# Altium schematic sheet ESP32 with USBC.SchDoc (part 2 of 3)
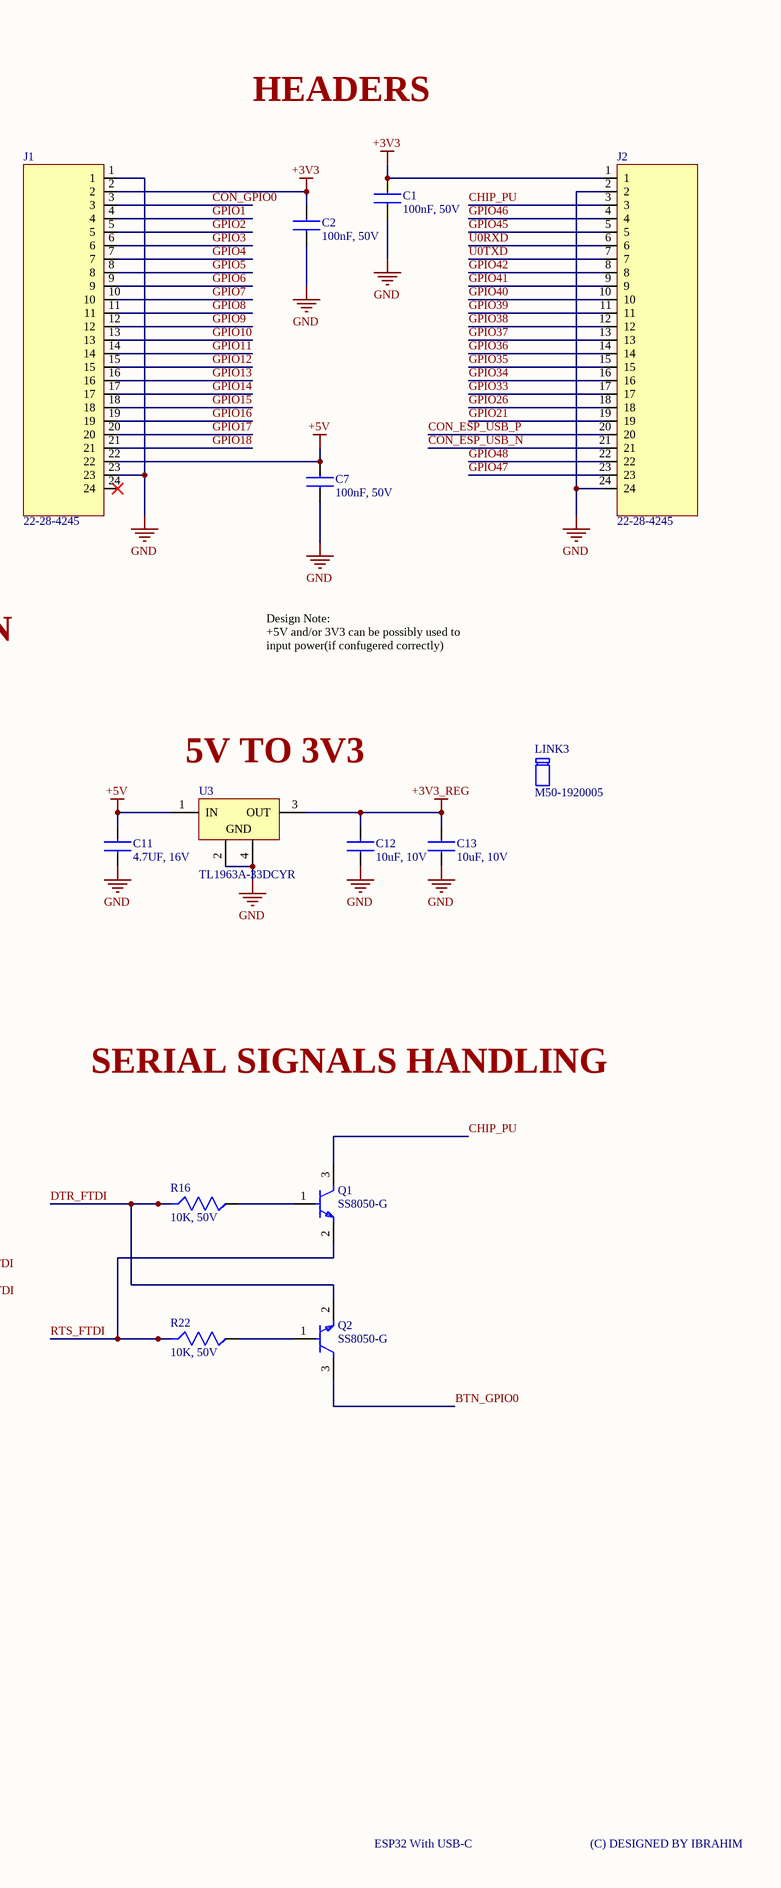
[diagram p2: ESP32 with USBC.SchDoc, right]
## Library data of the parts
C1-C3 C5-C10 C15 C17 = CL05B104KB54PNC: CAP CER 0.1UF 50V X7R 0402; Manufacturer: Samsung Electro-Mechanics; Dielectric Material: Ceramic; Tolerance: 10%; Supplier: DigiKey; Supplier Part Number: 1276-CL05B104KB54PNCCT-ND; Manufacturer Part Number: CL05B104KB54PNC; RoHS: Compliant; Category: Ceramic Capacitors; Pricing: 1=0.1, 10=0.036, 50=0.0246, 100=0.021, 500=0.01504, 1000=0.01387, 2500=0.01274, 5000=0.01196 (USD); Value: 100nF; Case/Package: 0402; China RoHS: Compliant; Height: 500µm; Length: 1mm; Lifecycle Status: Production; Material: Ceramic; Max Operating Temperature: 125°C; Min Operating Temperature: -55°C; Mounting Technology: Surface Mount; Number of Terminals: 2; REACH SVHC: Yes; Schedule B: 8532240020, 8532240020|8532240020|8532240020|8532240020|8532240020|8532240020|8532240020|8532240020|8532240020|8532240020|8532240020|8532240020|8532240020|8532240020|8532240020|8532240020|8532240020|8532240020|8532240020|8532240020|8532240020|8532240020|8532240020|85; Voltage Rating: 50V; Voltage Rating (DC): 50V; Width: 500µm; ComponentLink1URL: https://datasheet.octopart.com:443/CL05B104KB54PNC-Samsung-Electro-Mechanics-datasheet-182018727.pdf?src-supplier=IHS; ComponentLink1Description: https://datasheet.octopart.com:443/CL05B104KB54PNC-Samsung-Electro-Mechanics-datasheet-182018727.pdf?src-supplier=IHS; ComponentLink2URL: https://datasheet.octopart.com:443/CL05B104KB54PNC-Samsung-Electro-Mechanics-datasheet-138685816.pdf?src-supplier=Samsung+SCT; ComponentLink2Description: https://datasheet.octopart.com:443/CL05B104KB54PNC-Samsung-Electro-Mechanics-datasheet-138685816.pdf?src-supplier=Samsung+SCT; ComponentLink3URL: https://datasheet.octopart.com:443/CL05B104KB54PNC-Samsung-datasheet-8326407.pdf?src-supplier=TME; ComponentLink3Description: https://datasheet.octopart.com:443/CL05B104KB54PNC-Samsung-datasheet-8326407.pdf?src-supplier=TME; LCSC Part Number: C307331
C4 C11 = CMP-13271-001468-1: CAP CER 4.7UF 16V X5R 0402; Tolerance: 20%; Mount: Surface Mount; Case Code (Metric): 1005; Case/Package: 0402; Length: 0.039inch; Capacitance: 4.7uF; Voltage Rating: 16V; Max Operating Temperature: 85°C; Thickness: 0.022inch; Min Operating Temperature: -55°C; Case Code (Imperial): 0402; Packaging: Tape and Reel; Width: 0.02inch; LCSC Part Number: C318563
C12-C14 = CL05A106MP8NUB8: CAP CER 10UF 10V X5R 0402; Manufacturer: Samsung Electro-Mechanics; Value: 10µF; Dielectric Material: Ceramic; Tolerance: 20%; Supplier: DigiKey; Supplier Part Number: 1276-6830-1-ND; Manufacturer Part Number: CL05A106MP8NUB8; RoHS: Compliant; Category: Ceramic Capacitors; Stock: 167797; Pricing: 1=0.13, 10=0.077, 50=0.0678 (USD); Case/Package: 0402; Case Code (Imperial): 0402; Case Code (Metric): 1005; China RoHS: Compliant; Height: 800µm; Length: 1mm; Lifecycle Status: Production; Material: Ceramic; Max Operating Temperature: 85°C; Min Operating Temperature: -55°C; Mounting Technology: Surface Mount; Number of Terminals: 2; REACH SVHC: Yes; Schedule B: 8532240020, 8532240020|8532240020, 8532240020|8532240020|8532240020, 8532240020|8532240020|8532240020|8532240020; Thickness: 889µm; Voltage Rating: 10V; Voltage Rating (DC): 10V; Width: 500µm; ComponentLink1URL: https://datasheet.octopart.com:443/CL05A106MP8NUB8-Samsung-Electro-Mechanics-datasheet-136460857.pdf?src-supplier=IHS; ComponentLink1Description: https://datasheet.octopart.com:443/CL05A106MP8NUB8-Samsung-Electro-Mechanics-datasheet-136460857.pdf?src-supplier=IHS; ComponentLink2URL: https://datasheet.octopart.com:443/CL05A106MP8NUB8-Samsung-Electro-Mechanics-datasheet-181551178.pdf?src-supplier=Newark; ComponentLink2Description: https://datasheet.octopart.com:443/CL05A106MP8NUB8-Samsung-Electro-Mechanics-datasheet-181551178.pdf?src-supplier=Newark; ComponentLink3URL: https://datasheet.octopart.com:443/CL05A106MP8NUB8-Samsung-Electro-Mechanics-datasheet-136031724.pdf?src-supplier=Newark; ComponentLink3Description: https://datasheet.octopart.com:443/CL05A106MP8NUB8-Samsung-Electro-Mechanics-datasheet-136031724.pdf?src-supplier=Newark; ComponentLink4URL: https://datasheet.octopart.com:443/CL05A106MP8NUB8-Samsung-Electro-Mechanics-datasheet-141346815.pdf?src-supplier=Samsung+SCT; ComponentLink4Description: https://datasheet.octopart.com:443/CL05A106MP8NUB8-Samsung-Electro-Mechanics-datasheet-141346815.pdf?src-supplier=Samsung+SCT; ComponentLink5URL: https://datasheet.octopart.com:443/CL05A106MP8NUB8-Samsung-Electro-Mechanics-datasheet-110326781.pdf?src-supplier=Future+Electronics; ComponentLink5Description: https://datasheet.octopart.com:443/CL05A106MP8NUB8-Samsung-Electro-Mechanics-datasheet-110326781.pdf?src-supplier=Future+Electronics; ComponentLink6URL: https://datasheet.octopart.com:443/CL05A106MP8NUB8-Samsung-Electro-Mechanics-datasheet-96443587.pdf?src-supplier=Future+Electronics; ComponentLink6Description: https://datasheet.octopart.com:443/CL05A106MP8NUB8-Samsung-Electro-Mechanics-datasheet-96443587.pdf?src-supplier=Future+Electronics; ComponentLink7URL: https://datasheet.octopart.com:443/CL05A106MP8NUB8-Samsung-Electro-Mechanics-datasheet-68297032.pdf?src-supplier=Future+Electronics; ComponentLink7Description: https://datasheet.octopart.com:443/CL05A106MP8NUB8-Samsung-Electro-Mechanics-datasheet-68297032.pdf?src-supplier=Future+Electronics; ComponentLink8URL: https://datasheet.octopart.com:443/CL05A106MP8NUB8-Samsung-Electro-Mechanics-datasheet-86032222.pdf?src-supplier=Future+Electronics; ComponentLink8Description: https://datasheet.octopart.com:443/CL05A106MP8NUB8-Samsung-Electro-Mechanics-datasheet-86032222.pdf?src-supplier=Future+Electronics; LCSC Part Number: C307415
C16 = CL05A105KL5NRNC: CAP CER 1UF 35V X5R 0402; Manufacturer: Samsung Electro-Mechanics; Value: 1µF; Dielectric Material: Ceramic; Tolerance: 10%; Supplier: DigiKey; Supplier Part Number: 1276-6796-1-ND; Manufacturer Part Number: CL05A105KL5NRNC; RoHS: Compliant; Category: Ceramic Capacitors; Stock: 182369; Pricing: 1=0.27, 10=0.159, 50=0.1154, 100=0.102, 500=0.08134, 1000=0.07576, 2500=0.07016, 5000=0.06315 (USD); Case/Package: 0402; Case Code (Imperial): 0402; Case Code (Metric): 1005; China RoHS: Compliant; Height: 550µm; Length: 990.6µm; Lifecycle Status: Production; Material: Ceramic; Max Operating Temperature: 85°C; Min Operating Temperature: -55°C; Mounting Technology: Surface Mount; Number of Terminals: 2; REACH SVHC: Yes; Schedule B: 8532240020, 8532240020|8532240020|8532240020|8532240020|8532240020; Thickness: 558.8µm; Voltage Rating: 35V; Voltage Rating (DC): 35V; Width: 508µm; ComponentLink1URL: https://datasheet.octopart.com:443/CL05A105KL5NRNC-Samsung-Electro-Mechanics-datasheet-182018568.pdf?src-supplier=IHS; ComponentLink1Description: https://datasheet.octopart.com:443/CL05A105KL5NRNC-Samsung-Electro-Mechanics-datasheet-182018568.pdf?src-supplier=IHS; ComponentLink2URL: https://datasheet.octopart.com:443/CL05A105KL5NRNC-Samsung-Electro-Mechanics-datasheet-141346806.pdf?src-supplier=Samsung+SCT; ComponentLink2Description: https://datasheet.octopart.com:443/CL05A105KL5NRNC-Samsung-Electro-Mechanics-datasheet-141346806.pdf?src-supplier=Samsung+SCT; ComponentLink3URL: https://datasheet.octopart.com:443/CL05A105KL5NRNC-Samsung-datasheet-8326407.pdf?src-supplier=TME; ComponentLink3Description: https://datasheet.octopart.com:443/CL05A105KL5NRNC-Samsung-datasheet-8326407.pdf?src-supplier=TME; LCSC Part Number: C307413
D1 = VLMG1500-GS08: LED YLW-GRN 0402 SMD; Manufacturer: Vishay; Color: Green, Yellow; Dominant Wavelength: 571nm; Forward Current: 30mA; Forward Voltage: 2.4V; Lens Color: Clear; Lens Style: Rectangular; Luminous Intensity: 18mcd; Number of Circuits: 1; Power Dissipation: 75mW; Reverse Voltage: 5V; Test Current: 20mA; Viewing Angle: 130°; Supplier: DigiKey; Supplier Part Number: VLMG1500-GS08CT-ND; Manufacturer Part Number: VLMG1500-GS08; RoHS: Compliant; Category: LEDs; Stock: 161716; Pricing: 1=0.24, 10=0.164, 100=0.1147, 500=0.09218, 1000=0.0847 (USD); Ambient Temperature Range High: 85°C; Case/Package: 0402; Case Code (Imperial): 0402; Case Code (Metric): 1005; Depth: 500µm; Height: 350µm; Illumination Color: Green; Lead Free: Lead Free; Length: 1mm; Lifecycle Status: Production; Max Operating Temperature: 85°C; Min Operating Temperature: -30°C; Mounting Technology: Surface Mount; Number of Elements: 1; Number of LEDs: 1; Pins: 2; Number of Terminals: 2; Packaging: Cut Tape; Peak Wavelength: 571nm; Power Rating: 75mW; Radiation Hardening: No; REACH SVHC: Yes; Schedule B: 8541402000, 8541402000|8541402000|8541402000|8541402000|8541402000; Shape: Rectangular; Terminal Pitch: 675µm; Wavelength: 571nm; Width: 500µm; ComponentLink1URL: https://datasheet.octopart.com:443/VLMG1500-GS08-Vishay-datasheet-181477802.pdf?src-supplier=IHS; ComponentLink1Description: https://datasheet.octopart.com:443/VLMG1500-GS08-Vishay-datasheet-181477802.pdf?src-supplier=IHS; ComponentLink2URL: https://datasheet.octopart.com:443/VLMG1500-GS08-Vishay-datasheet-21227148.pdf?src-supplier=element14+APAC; ComponentLink2Description: https://datasheet.octopart.com:443/VLMG1500-GS08-Vishay-datasheet-21227148.pdf?src-supplier=element14+APAC; ComponentLink3URL: https://datasheet.octopart.com:443/VLMG1500-GS08-Vishay-datasheet-33014519.pdf?src-supplier=element14+APAC; ComponentLink3Description: https://datasheet.octopart.com:443/VLMG1500-GS08-Vishay-datasheet-33014519.pdf?src-supplier=element14+APAC; ComponentLink4URL: https://datasheet.octopart.com:443/VLMG1500-GS08-Vishay-datasheet-62332426.pdf?src-supplier=Newark; ComponentLink4Description: https://datasheet.octopart.com:443/VLMG1500-GS08-Vishay-datasheet-62332426.pdf?src-supplier=Newark; ComponentLink5URL: https://datasheet.octopart.com:443/VLMG1500-GS08-Vishay-datasheet-102762782.pdf?src-supplier=Future+Electronics; ComponentLink5Description: https://datasheet.octopart.com:443/VLMG1500-GS08-Vishay-datasheet-102762782.pdf?src-supplier=Future+Electronics; ComponentLink6URL: https://datasheet.octopart.com:443/VLMG1500-GS08-Vishay-datasheet-68326145.pdf?src-supplier=TME; ComponentLink6Description: https://datasheet.octopart.com:443/VLMG1500-GS08-Vishay-datasheet-68326145.pdf?src-supplier=TME; ComponentLink7URL: http://sigma.octopart.com:80/rohs_statement/Vishay-company-15.pdf?src-supplier=Compliance+Statements; ComponentLink7Description: http://sigma.octopart.com:80/rohs_statement/Vishay-company-15.pdf?src-supplier=Compliance+Statements; LCSC Part Number: C511404
D2 = VLMS1500-GS08: LED RED 0402 SMD; Manufacturer: Vishay; Dominant Wavelength: 631nm; Forward Current: 30mA; Forward Voltage: 2.4V; Lens Style: Rectangular, Square; Luminous Intensity: 18mcd; Number of Circuits: 1; Power Rating: 75mW; Reverse Voltage: 5V; Shape: Rectangular; Test Current: 20mA; Viewing Angle: 130°; Supplier: DigiKey; Supplier Part Number: VLMS1500-GS08CT-ND; Manufacturer Part Number: VLMS1500-GS08; RoHS: Compliant; Category: LEDs; Stock: 40375; Pricing: 1=0.24, 10=0.164, 100=0.1147, 500=0.09218, 1000=0.0847 (USD); Case/Package: 0402; Case Code (Imperial): 0402; Case Code (Metric): 1005; Color: Red; Height: 350µm; Illumination Color: Red; Lead Free: Lead Free; Length: 1mm; Lifecycle Status: Production; Max Operating Temperature: 85°C; Min Operating Temperature: -30°C; Mounting Technology: Surface Mount; Number of LEDs: 1; Pins: 2; Number of Terminals: 2; Packaging: Cut Tape; Peak Wavelength: 631nm; Radiation Hardening: No; REACH SVHC: Yes; Schedule B: 8541402000, 8541402000|8541402000|8541402000|8541402000|8541402000; Terminal Pitch: 675µm; Wavelength: 631nm; Width: 500µm; ComponentLink1URL: https://datasheet.octopart.com:443/VLMS1500-GS08-Vishay-datasheet-181477802.pdf?src-supplier=IHS; ComponentLink1Description: https://datasheet.octopart.com:443/VLMS1500-GS08-Vishay-datasheet-181477802.pdf?src-supplier=IHS; ComponentLink2URL: https://datasheet.octopart.com:443/VLMS1500-GS08-Vishay-datasheet-21227148.pdf?src-supplier=Future+Electronics; ComponentLink2Description: https://datasheet.octopart.com:443/VLMS1500-GS08-Vishay-datasheet-21227148.pdf?src-supplier=Future+Electronics; ComponentLink3URL: https://datasheet.octopart.com:443/VLMS1500-GS08-Vishay-datasheet-102762782.pdf?src-supplier=Future+Electronics; ComponentLink3Description: https://datasheet.octopart.com:443/VLMS1500-GS08-Vishay-datasheet-102762782.pdf?src-supplier=Future+Electronics; ComponentLink4URL: https://datasheet.octopart.com:443/VLMS1500-GS08-Vishay-datasheet-33014519.pdf?src-supplier=element14+APAC; ComponentLink4Description: https://datasheet.octopart.com:443/VLMS1500-GS08-Vishay-datasheet-33014519.pdf?src-supplier=element14+APAC; ComponentLink5URL: https://datasheet.octopart.com:443/VLMS1500-GS08-Vishay-datasheet-68326145.pdf?src-supplier=TME; ComponentLink5Description: https://datasheet.octopart.com:443/VLMS1500-GS08-Vishay-datasheet-68326145.pdf?src-supplier=TME; ComponentLink6URL: https://datasheet.octopart.com:443/VLMS1500-GS08-Vishay-Siliconix-datasheet-62309867.pdf?src-supplier=RS+(Formerly+Allied+Electronics); ComponentLink6Description: https://datasheet.octopart.com:443/VLMS1500-GS08-Vishay-Siliconix-datasheet-62309867.pdf?src-supplier=RS+(Formerly+Allied+Electronics); ComponentLink7URL: https://datasheet.octopart.com:443/VLMS1500-GS08-Vishay-datasheet-62332426.pdf?src-supplier=Newark; ComponentLink7Description: https://datasheet.octopart.com:443/VLMS1500-GS08-Vishay-datasheet-62332426.pdf?src-supplier=Newark; ComponentLink8URL: https://datasheet.octopart.com/VLMS1500-GS08-Vishay-datasheet-16093911.pdf; ComponentLink8Description: https://datasheet.octopart.com/VLMS1500-GS08-Vishay-datasheet-16093911.pdf; ComponentLink9URL: http://sigma.octopart.com:80/rohs_statement/Vishay-company-15.pdf?src-supplier=Compliance+Statements; ComponentLink9Description: http://sigma.octopart.com:80/rohs_statement/Vishay-company-15.pdf?src-supplier=Compliance+Statements; LCSC Part Number: C511370
D3-D8 = AQ3045-01ETG: TVS DIODE 5.3VWM 12VC SOD882; Manufacturer: Littelfuse; Breakdown Voltage: 7.8V; Clamping Voltage: 12V; Leakage Current: 100nA; Max Breakdown Voltage: 9V; Min Breakdown Voltage: 6.8V; Number of Channels: 1; Operating Supply Voltage: 5.3V; Peak Pulse Power: 40W; Polarity: Bidirectional; Supplier: DigiKey; Supplier Part Number: F9321CT-ND; Manufacturer Part Number: AQ3045-01ETG; RoHS: Compliant; Category: TVS Diodes; Stock: 10179; Pricing: 1=0.43, 10=0.271, 100=0.141, 500=0.131 (USD); Lifecycle Status: Production; Max Operating Temperature: 150°C; Min Operating Temperature: -40°C; Mounting Technology: Surface Mount; Number of Elements: 1; Number of Terminals: 2; Packaging: Cut Tape; Peak Reverse Current: 100nA; REACH SVHC: Yes; Reverse Standoff Voltage: 5.3V; ComponentLink1URL: https://datasheet.octopart.com:443/AQ3045-01ETG-Littelfuse-datasheet-180606588.pdf?src-supplier=IHS; ComponentLink1Description: https://datasheet.octopart.com:443/AQ3045-01ETG-Littelfuse-datasheet-180606588.pdf?src-supplier=IHS; ComponentLink2URL: https://datasheet.octopart.com:443/AQ3045-01ETG-Littelfuse-datasheet-140480283.pdf?src-supplier=ODG+(Origin+Data+Global); ComponentLink2Description: https://datasheet.octopart.com:443/AQ3045-01ETG-Littelfuse-datasheet-140480283.pdf?src-supplier=ODG+(Origin+Data+Global); ComponentLink3URL: https://datasheet.octopart.com:443/AQ3045-01ETG-Littelfuse-datasheet-101609968.pdf?src-supplier=Farnell; ComponentLink3Description: https://datasheet.octopart.com:443/AQ3045-01ETG-Littelfuse-datasheet-101609968.pdf?src-supplier=Farnell; ComponentLink4URL: https://datasheet.octopart.com:443/AQ3045-01ETG-Littelfuse-datasheet-183003566.pdf?src-supplier=JRH+Electronics; ComponentLink4Description: https://datasheet.octopart.com:443/AQ3045-01ETG-Littelfuse-datasheet-183003566.pdf?src-supplier=JRH+Electronics; ComponentLink5URL: https://datasheet.octopart.com:443/AQ3045-01ETG-Littelfuse-datasheet-170904929.pdf?src-supplier=Future+Electronics; ComponentLink5Description: https://datasheet.octopart.com:443/AQ3045-01ETG-Littelfuse-datasheet-170904929.pdf?src-supplier=Future+Electronics; LCSC Part Number: C3710326
J1 J2 = 22-28-4245: Conn Unshrouded Header HDR 24 POS 2.54mm Solder ST Thru-Hole KK® Bag; Manufacturer: Molex; Manufacturer Lifecycle Status: ACTIVE; Contact Resistance: 20mΩ; Current Rating: 4A; Gender: Male; Insulation Resistance: 50GΩ; Number of Circuits: 24; Plating: Tin; Plating Thickness: 381nm; Supplier: DigiKey; Supplier Part Number: 900-0022284245-ND; Manufacturer Part Number: 22-28-4245; RoHS: Compliant; Category: Headers and Wire Housings; Stock: 1314; Pricing: 1=1.21, 10=1.024, 100=0.8699, 500=0.77638, 1000=0.73932, 5000=0.65998, 10000=0.62851 (USD); China RoHS: Compliant; Contact Gender: Male; Contact Material: Brass; Contact Plating: Gold; Country of Origin: US; Housing Color: Black; Lead Free: Lead Free; Lifecycle Status: Production; Max Operating Temperature: 75°C; Min Operating Temperature: -40°C; Mounting Technology: Through Hole; Number of Contacts: 24; Pins: 24; Number of Positions: 24; Number of Rows: 1; Orientation: Vertical; Packaging: Bulk; Pitch: 2.54mm; REACH SVHC: Yes; Schedule B: 8536694040, 8536694040|8536694040|8536694040|8536694040|8536694040; Terminal Pitch: 2.54mm; Termination: Solder; ComponentLink1URL: https://datasheet.octopart.com:443/22-28-4245-Molex-datasheet-166051265.pdf?src-supplier=IHS; ComponentLink1Description: https://datasheet.octopart.com:443/22-28-4245-Molex-datasheet-166051265.pdf?src-supplier=IHS; ComponentLink2URL: https://datasheet.octopart.com:443/022284245-Molex-datasheet-8337137.pdf?src-supplier=Arrow+Electronics; ComponentLink2Description: https://datasheet.octopart.com:443/022284245-Molex-datasheet-8337137.pdf?src-supplier=Arrow+Electronics; ComponentLink3URL: https://datasheet.octopart.com:443/22-28-4245-Molex-datasheet-16300812.pdf?src-supplier=Molex; ComponentLink3Description: https://datasheet.octopart.com:443/22-28-4245-Molex-datasheet-16300812.pdf?src-supplier=Molex; ComponentLink4URL: https://sigma.octopart.com:443/16300370/technical_drawing/Molex-22-28-4245.pdf?src-supplier=Molex; ComponentLink4Description: https://sigma.octopart.com:443/16300370/technical_drawing/Molex-22-28-4245.pdf?src-supplier=Molex; ComponentLink5URL: https://datasheet.octopart.com:443/22-28-4245-Molex-datasheet-4210.pdf?src-supplier=DigiKey; ComponentLink5Description: https://datasheet.octopart.com:443/22-28-4245-Molex-datasheet-4210.pdf?src-supplier=DigiKey; ComponentLink6URL: http://sigma.octopart.com:80/16300813/rohs_statement/Molex-22-28-4245.pdf?src-supplier=Compliance+Statements; ComponentLink6Description: http://sigma.octopart.com:80/16300813/rohs_statement/Molex-22-28-4245.pdf?src-supplier=Compliance+Statements; ComponentLink7URL: http://sigma.octopart.com:80/reach_statement/Molex-company-74.pdf?src-supplier=Compliance+Statements; ComponentLink7Description: http://sigma.octopart.com:80/reach_statement/Molex-company-74.pdf?src-supplier=Compliance+Statements; ComponentLink8URL: http://sigma.octopart.com:80/rohs_statement/Molex-company-73.pdf?src-supplier=Compliance+Statements; ComponentLink8Description: http://sigma.octopart.com:80/rohs_statement/Molex-company-73.pdf?src-supplier=Compliance+Statements; ComponentLink9URL: http://sigma.octopart.com:80/conflict_mineral_statement/Molex-company-72.pdf?src-supplier=Compliance+Statements; ComponentLink9Description: http://sigma.octopart.com:80/conflict_mineral_statement/Molex-company-72.pdf?src-supplier=Compliance+Statements; LCSC Part Number: C7145888
J3 J4 = 217179-0001: CONN RCP USB2.0 TYP C 24P SMD RA; Manufacturer: Molex; Contact Resistance: 50mΩ; Current Rating: 1.25A; Dielectric Material: Polyamide; Gender: Receptacle; Insulation Resistance: 100MΩ; Number of Contacts: 16; Number of Ports: 1; Voltage Rating: 30V; Supplier: DigiKey; Supplier Part Number: 900-2171790001CT-ND; Manufacturer Part Number: 217179-0001; RoHS: Compliant; Category: USB Connectors; Stock: 25630; Pricing: 1=0.83, 10=0.704, 25=0.6596, 50=0.628, 100=0.598, 250=0.56052, 500=0.53374 (USD); Contact Gender: Female; Contact Material: Gold, Nickel; Height: 3.36mm; Lifecycle Status: Production; Max Operating Temperature: 85°C; Min Operating Temperature: -40°C; Pins: 16; Number of Rows: 1; REACH SVHC: Yes; Shell Finish: Nickel; Shell Material: Stainless Steel; Terminal Pitch: 500µm; USB Standard: USB 2.0; ComponentLink1URL: https://datasheet.octopart.com:443/217179-0001-Molex-datasheet-158871109.pdf?src-supplier=ODG+(Origin+Data+Global); ComponentLink1Description: https://datasheet.octopart.com:443/217179-0001-Molex-datasheet-158871109.pdf?src-supplier=ODG+(Origin+Data+Global); ComponentLink2URL: https://sigma.octopart.com:443/158871110/technical_drawing/Molex-217179-0001.pdf?src-supplier=Upverter; ComponentLink2Description: https://sigma.octopart.com:443/158871110/technical_drawing/Molex-217179-0001.pdf?src-supplier=Upverter; ComponentLink3URL: https://datasheet.octopart.com:443/217179-0001-Molex-datasheet-164573281.pdf?src-supplier=RS+(Formerly+Allied+Electronics); ComponentLink3Description: https://datasheet.octopart.com:443/217179-0001-Molex-datasheet-164573281.pdf?src-supplier=RS+(Formerly+Allied+Electronics); ComponentLink4URL: http://sigma.octopart.com:80/reach_statement/Molex-company-74.pdf?src-supplier=Compliance+Statements; ComponentLink4Description: http://sigma.octopart.com:80/reach_statement/Molex-company-74.pdf?src-supplier=Compliance+Statements; ComponentLink5URL: http://sigma.octopart.com:80/rohs_statement/Molex-company-73.pdf?src-supplier=Compliance+Statements; ComponentLink5Description: http://sigma.octopart.com:80/rohs_statement/Molex-company-73.pdf?src-supplier=Compliance+Statements; ComponentLink6URL: http://sigma.octopart.com:80/conflict_mineral_statement/Molex-company-72.pdf?src-supplier=Compliance+Statements; ComponentLink6Description: http://sigma.octopart.com:80/conflict_mineral_statement/Molex-company-72.pdf?src-supplier=Compliance+Statements; LCSC Part Number: C3197684
J5 = FTS-102-01-F-S: CONN HEADER VERT 2POS 1.27MM; Manufacturer: Samtec; Manufacturer Lifecycle Status: PRODUCTION; Gender: Male; Number of Contacts: 2; Supplier: DigiKey; Supplier Part Number: SAM15176-ND; Manufacturer Part Number: FTS-102-01-F-S; RoHS: Compliant; Category: Headers and Wire Housings; Pricing: 1=0.49, 50=0.4252, 100=0.3608, 500=0.2994, 1000=0.25609, 2000=0.2556 (USD); Contact Plating: Gold; Lifecycle Status: Production; Mounting Technology: Through Hole; Number of Rows: 1; Packaging: Bulk; Pitch: 1.27mm; Radiation Hardening: No; Termination: Solder; ComponentLink1URL: https://datasheet.octopart.com:443/FTS-102-01-F-S-Samtec-datasheet-97029283.pdf?src-supplier=Newark; ComponentLink1Description: https://datasheet.octopart.com:443/FTS-102-01-F-S-Samtec-datasheet-97029283.pdf?src-supplier=Newark; ComponentLink2URL: https://sigma.octopart.com:443/97029285/technical_drawing/Samtec-FTS-102-01-F-S.pdf?src-supplier=Newark; ComponentLink2Description: https://sigma.octopart.com:443/97029285/technical_drawing/Samtec-FTS-102-01-F-S.pdf?src-supplier=Newark; ComponentLink3URL: https://datasheet.octopart.com:443/FTS-102-01-F-S-Samtec-datasheet-118493358.pdf?src-supplier=Electro+Sonic; ComponentLink3Description: https://datasheet.octopart.com:443/FTS-102-01-F-S-Samtec-datasheet-118493358.pdf?src-supplier=Electro+Sonic; ComponentLink4URL: https://datasheet.octopart.com:443/FTS-102-01-F-S-Samtec-datasheet-165596534.pdf?src-supplier=JRH+Electronics; ComponentLink4Description: https://datasheet.octopart.com:443/FTS-102-01-F-S-Samtec-datasheet-165596534.pdf?src-supplier=JRH+Electronics; ComponentLink5URL: https://datasheet.octopart.com:443/FTS-102-01-F-S-Samtec-datasheet-176663378.pdf?src-supplier=Toby+Electronics; ComponentLink5Description: https://datasheet.octopart.com:443/FTS-102-01-F-S-Samtec-datasheet-176663378.pdf?src-supplier=Toby+Electronics; ComponentLink6URL: https://datasheet.octopart.com:443/FTS-102-01-F-S-Samtec-datasheet-116535195.pdf?src-supplier=Toby+Electronics; ComponentLink6Description: https://datasheet.octopart.com:443/FTS-102-01-F-S-Samtec-datasheet-116535195.pdf?src-supplier=Toby+Electronics; ComponentLink7URL: https://datasheet.octopart.com:443/FTS-102-01-F-S-Samtec-datasheet-136395376.pdf?src-supplier=Toby+Electronics; ComponentLink7Description: https://datasheet.octopart.com:443/FTS-102-01-F-S-Samtec-datasheet-136395376.pdf?src-supplier=Toby+Electronics; ComponentLink8URL: https://datasheet.octopart.com:443/FTS-102-01-F-S-Samtec-datasheet-151470456.pdf?src-supplier=Sager+Electronics; ComponentLink8Description: https://datasheet.octopart.com:443/FTS-102-01-F-S-Samtec-datasheet-151470456.pdf?src-supplier=Sager+Electronics; LCSC Part Number: C6045317
J6 = FTS-103-01-F-S: CONN HEADER VERT 3POS 1.27MM; Manufacturer: Samtec; Manufacturer Lifecycle Status: PRODUCTION; Gender: Male; Number of Contacts: 3; Supplier: DigiKey; Supplier Part Number: 612-FTS-103-01-F-S-ND; Manufacturer Part Number: FTS-103-01-F-S; RoHS: Compliant; Category: Headers and Wire Housings; Stock: 2300; Pricing: 1=0.73, 50=0.6378, 100=0.5407, 500=0.4491, 1000=0.38362, 2000=0.31431, 5000=0.29982 (USD); Contact Plating: Gold; Lifecycle Status: Production; Mounting Technology: Through Hole; Number of Rows: 1; Packaging: Bulk; Pitch: 1.27mm; Radiation Hardening: No; Termination: Solder; ComponentLink1URL: https://datasheet.octopart.com:443/FTS-103-01-F-S-Samtec-datasheet-97029283.pdf?src-supplier=Newark; ComponentLink1Description: https://datasheet.octopart.com:443/FTS-103-01-F-S-Samtec-datasheet-97029283.pdf?src-supplier=Newark; ComponentLink2URL: https://datasheet.octopart.com:443/FTS-103-01-F-S-Samtec-datasheet-165596534.pdf?src-supplier=Newark; ComponentLink2Description: https://datasheet.octopart.com:443/FTS-103-01-F-S-Samtec-datasheet-165596534.pdf?src-supplier=Newark; ComponentLink3URL: https://sigma.octopart.com:443/97029285/technical_drawing/Samtec-FTS-103-01-F-S.pdf?src-supplier=element14+APAC; ComponentLink3Description: https://sigma.octopart.com:443/97029285/technical_drawing/Samtec-FTS-103-01-F-S.pdf?src-supplier=element14+APAC; ComponentLink4URL: https://datasheet.octopart.com:443/FTS-103-01-F-S-Samtec-datasheet-118493358.pdf?src-supplier=Electro+Sonic; ComponentLink4Description: https://datasheet.octopart.com:443/FTS-103-01-F-S-Samtec-datasheet-118493358.pdf?src-supplier=Electro+Sonic; ComponentLink5URL: https://datasheet.octopart.com:443/FTS-103-01-F-S-Samtec-datasheet-176663378.pdf?src-supplier=Toby+Electronics; ComponentLink5Description: https://datasheet.octopart.com:443/FTS-103-01-F-S-Samtec-datasheet-176663378.pdf?src-supplier=Toby+Electronics; ComponentLink6URL: https://datasheet.octopart.com:443/FTS-103-01-F-S-Samtec-datasheet-116535195.pdf?src-supplier=Toby+Electronics; ComponentLink6Description: https://datasheet.octopart.com:443/FTS-103-01-F-S-Samtec-datasheet-116535195.pdf?src-supplier=Toby+Electronics; ComponentLink7URL: https://datasheet.octopart.com:443/FTS-103-01-F-S-Samtec-datasheet-136395376.pdf?src-supplier=Toby+Electronics; ComponentLink7Description: https://datasheet.octopart.com:443/FTS-103-01-F-S-Samtec-datasheet-136395376.pdf?src-supplier=Toby+Electronics; ComponentLink8URL: https://datasheet.octopart.com:443/FTS-103-01-F-S-Samtec-datasheet-151470456.pdf?src-supplier=Sager+Electronics; ComponentLink8Description: https://datasheet.octopart.com:443/FTS-103-01-F-S-Samtec-datasheet-151470456.pdf?src-supplier=Sager+Electronics; LCSC Part Number: C3333578
LINK1-LINK3 = M50-1920005: CONN SHUNT 1.27MM RED; Manufacturer: Harwin; Contact Resistance: 20mΩ; Current Rating: 1A; Insulation Resistance: 1GΩ; Number of Positions: 2; Voltage Rating: 500V; Supplier: DigiKey; Supplier Part Number: 952-1727-ND; Manufacturer Part Number: M50-1920005; RoHS: Compliant; Category: Headers and Wire Housings; Stock: 9191; Pricing: 1=0.33, 10=0.284, 25=0.2664, 50=0.2536, 100=0.2414, 250=0.22628, 500=0.21546, 1000=0.20516, 3000=0.18984 (USD); Color: Red; Contact Gender: Female; Contact Plating: Gold; Flammability Rating: UL94 V-0; Height: 2.9972mm; Housing Material: Nylon; Lifecycle Status: Production; Max Operating Temperature: 105°C; Min Operating Temperature: -40°C; Pins: 2; Pitch: 1.27mm; REACH SVHC: Yes; ComponentLink1URL: https://datasheet.octopart.com:443/M50-1920005-Harwin-datasheet-179992058.pdf?src-supplier=IHS; ComponentLink1Description: https://datasheet.octopart.com:443/M50-1920005-Harwin-datasheet-179992058.pdf?src-supplier=IHS; ComponentLink2URL: https://datasheet.octopart.com:443/M50-1920005-Harwin-datasheet-27707384.pdf?src-supplier=Newark; ComponentLink2Description: https://datasheet.octopart.com:443/M50-1920005-Harwin-datasheet-27707384.pdf?src-supplier=Newark; ComponentLink3URL: https://datasheet.octopart.com:443/M50-1920005-Harwin-datasheet-10841850.pdf?src-supplier=element14+APAC; ComponentLink3Description: https://datasheet.octopart.com:443/M50-1920005-Harwin-datasheet-10841850.pdf?src-supplier=element14+APAC; LCSC Part Number: C6985646
Q1 Q2 = SS8050-G: TRANS NPN 25V 1.5A SOT-23-3; Manufacturer: Comchip; Collector Base Voltage (VCBO): 40V; Collector Emitter Saturation Voltage: 500mV; Emitter Base Voltage (VEBO): 5V; hFE Min: 40; Max Junction Temperature (Tj): 150°C; Max Power Dissipation: 300mW; Number of Elements: 1; Transition Frequency: 100MHz; Supplier: DigiKey; Supplier Part Number: 641-1790-1-ND; Manufacturer Part Number: SS8050-G; RoHS: Compliant; Category: BJTs; Stock: 54511; Pricing: 1=0.24, 10=0.148, 100=0.0921, 500=0.06754, 1000=0.05958 (USD); Case/Package: TO-236-3; Collector Emitter Breakdown Voltage: 25V; Collector Emitter Voltage (VCEO): 25V; Height: 1.15mm; Lifecycle Status: Production; Max Breakdown Voltage: 25V; Max Collector Current: 1.5A; Max Operating Temperature: 150°C; Mounting Technology: Surface Mount; Number of Terminals: 3; Power Dissipation: 300mW; REACH SVHC: Yes; Schedule B: 8541100070|8541100070|8541100070|8541100070|8541100070; ComponentLink1URL: https://datasheet.octopart.com:443/SS8050-G-Comchip-datasheet-180131983.pdf?src-supplier=IHS; ComponentLink1Description: https://datasheet.octopart.com:443/SS8050-G-Comchip-datasheet-180131983.pdf?src-supplier=IHS; ComponentLink2URL: https://datasheet.octopart.com:443/SS8050-G-Comchip-datasheet-155422643.pdf?src-supplier=Upverter; ComponentLink2Description: https://datasheet.octopart.com:443/SS8050-G-Comchip-datasheet-155422643.pdf?src-supplier=Upverter; ComponentLink3URL: https://datasheet.octopart.com:443/SS8050-G-Comchip-datasheet-189767092.pdf?src-supplier=ODG+(Origin+Data+Global); ComponentLink3Description: https://datasheet.octopart.com:443/SS8050-G-Comchip-datasheet-189767092.pdf?src-supplier=ODG+(Origin+Data+Global); LCSC Part Number: C3199946
R1-R3 R8 R18 R21 R23-R26 = RC0402JR-070RL: RES 0 OHM JUMPER 1/16W 0402; Manufacturer: Yageo Group; Max Power Dissipation: 63mW; Power Dissipation: 62.5mW; Value: 0Ω; Temperature Coefficient: 200ppm/°C; Tolerance: 5%; Voltage Rating: 50V; Supplier: DigiKey; Supplier Part Number: 311-0.0JRCT-ND; Manufacturer Part Number: RC0402JR-070RL; RoHS: Compliant; Category: Chip SMD Resistors; Stock: 18903371; Pricing: 1=0.1, 10=0.010, 25=0.0064, 50=0.0054, 100=0.0047, 250=0.00392, 500=0.00346, 1000=0.00304, 5000=0.0023 (USD); Case/Package: 0402; Case Code (Imperial): 0402; China RoHS: Non-Compliant; Composition: Thick Film; Contact Plating: Tin; Depth: 500µm; Features: Moisture Resistant; Height: 350µm; Lead Free: Lead Free; Length: 1mm; Lifecycle Status: Production; Max Operating Temperature: 155°C; Military Standard: Not; Min Operating Temperature: -55°C; Mounting Technology: Surface Mount; Pins: 2; Number of Terminals: 2; Number of Terminations: 2; Packaging: Tape & Reel; Power Rating: 63mW; Radiation Hardening: No; REACH SVHC: Yes; Schedule B: 8533290000, 8533290000|8533290000, 8533290000|8533290000|8533290000, 8533290000|8533290000|8533290000|8533290000; Termination: SMD/SMT; Voltage Rating (DC): 50V; Width: 500µm; ComponentLink1URL: https://datasheet.octopart.com:443/RC0402JR-070RL-Yageo-datasheet-182189538.pdf?src-supplier=IHS; ComponentLink1Description: https://datasheet.octopart.com:443/RC0402JR-070RL-Yageo-datasheet-182189538.pdf?src-supplier=IHS; ComponentLink2URL: https://datasheet.octopart.com:443/RC0402JR-070RL-Yageo-datasheet-10408619.pdf?src-supplier=Newark; ComponentLink2Description: https://datasheet.octopart.com:443/RC0402JR-070RL-Yageo-datasheet-10408619.pdf?src-supplier=Newark; ComponentLink3URL: https://datasheet.octopart.com:443/RC0402JR-070RL-Yageo-Group-datasheet-181964826.pdf?src-supplier=Newark; ComponentLink3Description: https://datasheet.octopart.com:443/RC0402JR-070RL-Yageo-Group-datasheet-181964826.pdf?src-supplier=Newark; ComponentLink4URL: https://datasheet.octopart.com:443/RC0402JR-070RL-Yageo-datasheet-12531192.pdf?src-supplier=Seeed+Studio; ComponentLink4Description: https://datasheet.octopart.com:443/RC0402JR-070RL-Yageo-datasheet-12531192.pdf?src-supplier=Seeed+Studio; ComponentLink5URL: https://datasheet.octopart.com:443/RC0402JR-070RL-Yageo-datasheet-8324527.pdf?src-supplier=TME; ComponentLink5Description: https://datasheet.octopart.com:443/RC0402JR-070RL-Yageo-datasheet-8324527.pdf?src-supplier=TME; ComponentLink6URL: https://datasheet.octopart.com:443/RC0402JR-070RL-Yageo-datasheet-62067350.pdf?src-supplier=Farnell; ComponentLink6Description: https://datasheet.octopart.com:443/RC0402JR-070RL-Yageo-datasheet-62067350.pdf?src-supplier=Farnell; ComponentLink7URL: https://datasheet.octopart.com:443/RC0402JR-070RL-Yageo-datasheet-8329306.pdf?src-supplier=element14; ComponentLink7Description: https://datasheet.octopart.com:443/RC0402JR-070RL-Yageo-datasheet-8329306.pdf?src-supplier=element14; ComponentLink8URL: https://datasheet.octopart.com:443/RC0402JR-070RL-Yageo-datasheet-505231.pdf?src-supplier=element14; ComponentLink8Description: https://datasheet.octopart.com:443/RC0402JR-070RL-Yageo-datasheet-505231.pdf?src-supplier=element14; ComponentLink9URL: https://datasheet.octopart.com:443/RC0402JR-070RL-Yageo-datasheet-175423674.pdf?src-supplier=SOS+electronic; ComponentLink9Description: https://datasheet.octopart.com:443/RC0402JR-070RL-Yageo-datasheet-175423674.pdf?src-supplier=SOS+electronic; ComponentLink10URL: https://datasheet.octopart.com:443/RC0402JR-070RL-Yageo-datasheet-164759695.pdf?src-supplier=Future+Electronics; ComponentLink10Description: https://datasheet.octopart.com:443/RC0402JR-070RL-Yageo-datasheet-164759695.pdf?src-supplier=Future+Electronics; ComponentLink11URL: https://datasheet.octopart.com:443/RC0402JR-070RL-Yageo-datasheet-137700087.pdf?src-supplier=Future+Electronics; ComponentLink11Description: https://datasheet.octopart.com:443/RC0402JR-070RL-Yageo-datasheet-137700087.pdf?src-supplier=Future+Electronics; ComponentLink12URL: https://datasheet.octopart.com/RC0402JR-070RL-Yageo-datasheet-73766026.pdf; ComponentLink12Description: https://datasheet.octopart.com/RC0402JR-070RL-Yageo-datasheet-73766026.pdf; ComponentLink13URL: http://sigma.octopart.com:80/conflict_mineral_statement/Yageo-company-3.pdf?src-supplier=Compliance+Statements; ComponentLink13Description: http://sigma.octopart.com:80/conflict_mineral_statement/Yageo-company-3.pdf?src-supplier=Compliance+Statements; ComponentLink14URL: http://sigma.octopart.com:80/rohs_statement/Yageo-company-2.pdf?src-supplier=Compliance+Statements; ComponentLink14Description: http://sigma.octopart.com:80/rohs_statement/Yageo-company-2.pdf?src-supplier=Compliance+Statements; LCSC Part Number: C60485
R4 R5 = RC0402FR-071KL: RES 1K OHM 1% 1/16W 0402; Manufacturer: Yageo Group; Power Dissipation: 62.5mW; Power Rating: 63mW; Value: 1kΩ; Temperature Coefficient: 100ppm/°C; Supplier: DigiKey; Supplier Part Number: 311-1.00KLRCT-ND; Manufacturer Part Number: RC0402FR-071KL; RoHS: Compliant; Category: Chip SMD Resistors; Stock: 2177165; Pricing: 1=0.1, 10=0.007, 25=0.0068, 50=0.0062, 100=0.0056, 250=0.00308 (USD); Case/Package: 0402; Case Code (Imperial): 0402; Case Code (Metric): 0402; China RoHS: Non-Compliant; Composition: Thick Film; Depth: 500µm; Height: 350µm; Lead Free: Lead Free; Length: 1mm; Lifecycle Status: Production; Max Operating Temperature: 155°C; Military Standard: Not; Min Operating Temperature: -55°C; Mounting Technology: Surface Mount; Pins: 2; Number of Terminals: 2; Packaging: Tape & Reel; REACH SVHC: Yes; Schedule B: 8533210045, 8533210045|8533210045|8533210045|8533210045|8533210045|8533210045|8533210045|8533210045|8533210045|8533210045|8533210045|8533210045|8533210045|8533210045|8533210045|8533210045|8533210045|8533210045|8533210045|8533210045|8533210045|8533210045|8533210045|85; Termination: SMD/SMT; Tolerance: 1%; Voltage Rating: 50V; Voltage Rating (AC): 50V; Voltage Rating (DC): 50V; Width: 500µm; Working Voltage: 50V; ComponentLink1URL: https://datasheet.octopart.com:443/RC0402FR-071KL-Yageo-datasheet-175887523.pdf?src-supplier=IHS; ComponentLink1Description: https://datasheet.octopart.com:443/RC0402FR-071KL-Yageo-datasheet-175887523.pdf?src-supplier=IHS; ComponentLink2URL: https://datasheet.octopart.com:443/RC0402FR-071KL-Yageo-datasheet-164759695.pdf?src-supplier=Upverter; ComponentLink2Description: https://datasheet.octopart.com:443/RC0402FR-071KL-Yageo-datasheet-164759695.pdf?src-supplier=Upverter; ComponentLink3URL: https://datasheet.octopart.com:443/RC0402FR-071KL-Yageo-datasheet-103092701.pdf?src-supplier=Upverter; ComponentLink3Description: https://datasheet.octopart.com:443/RC0402FR-071KL-Yageo-datasheet-103092701.pdf?src-supplier=Upverter; ComponentLink4URL: https://sigma.octopart.com:443/138820526/technical_drawing/Yageo-RC0402FR-071KL.pdf?src-supplier=Upverter; ComponentLink4Description: https://sigma.octopart.com:443/138820526/technical_drawing/Yageo-RC0402FR-071KL.pdf?src-supplier=Upverter; ComponentLink5URL: https://datasheet.octopart.com:443/RC0402FR-071KL-Yageo-datasheet-98239111.pdf?src-supplier=Upverter; ComponentLink5Description: https://datasheet.octopart.com:443/RC0402FR-071KL-Yageo-datasheet-98239111.pdf?src-supplier=Upverter; ComponentLink6URL: https://datasheet.octopart.com:443/RC0402FR-071KL-Yageo-datasheet-10408619.pdf?src-supplier=Newark; ComponentLink6Description: https://datasheet.octopart.com:443/RC0402FR-071KL-Yageo-datasheet-10408619.pdf?src-supplier=Newark; ComponentLink7URL: https://datasheet.octopart.com:443/RC0402FR-071KL-Yageo-datasheet-8324527.pdf?src-supplier=Newark; ComponentLink7Description: https://datasheet.octopart.com:443/RC0402FR-071KL-Yageo-datasheet-8324527.pdf?src-supplier=Newark; ComponentLink8URL: https://datasheet.octopart.com:443/RC0402FR-071KL-Yageo-datasheet-62067350.pdf?src-supplier=Farnell; ComponentLink8Description: https://datasheet.octopart.com:443/RC0402FR-071KL-Yageo-datasheet-62067350.pdf?src-supplier=Farnell; ComponentLink9URL: https://datasheet.octopart.com:443/RC0402FR-071KL-Yageo-datasheet-12531192.pdf?src-supplier=Future+Electronics; ComponentLink9Description: https://datasheet.octopart.com:443/RC0402FR-071KL-Yageo-datasheet-12531192.pdf?src-supplier=Future+Electronics; ComponentLink10URL: https://datasheet.octopart.com:443/RC0402FR-071KL-Yageo-datasheet-137700087.pdf?src-supplier=Future+Electronics; ComponentLink10Description: https://datasheet.octopart.com:443/RC0402FR-071KL-Yageo-datasheet-137700087.pdf?src-supplier=Future+Electronics; ComponentLink11URL: https://datasheet.octopart.com:443/RC0402FR-071KL-Yageo-datasheet-8324255.pdf?src-supplier=Future+Electronics; ComponentLink11Description: https://datasheet.octopart.com:443/RC0402FR-071KL-Yageo-datasheet-8324255.pdf?src-supplier=Future+Electronics; ComponentLink12URL: https://datasheet.octopart.com:443/RC0402FR-071KL-Yageo-datasheet-8329306.pdf?src-supplier=element14; ComponentLink12Description: https://datasheet.octopart.com:443/RC0402FR-071KL-Yageo-datasheet-8329306.pdf?src-supplier=element14; ComponentLink13URL: https://datasheet.octopart.com:443/RC0402FR-071KL-Yageo-datasheet-505231.pdf?src-supplier=element14; ComponentLink13Description: https://datasheet.octopart.com:443/RC0402FR-071KL-Yageo-datasheet-505231.pdf?src-supplier=element14; ComponentLink14URL: https://datasheet.octopart.com:443/RC0402FR-071KL-Yageo-datasheet-175423674.pdf?src-supplier=SOS+electronic; ComponentLink14Description: https://datasheet.octopart.com:443/RC0402FR-071KL-Yageo-datasheet-175423674.pdf?src-supplier=SOS+electronic; ComponentLink15URL: https://datasheet.octopart.com:443/RC0402FR-071KL-Yageo-datasheet-148775077.pdf?src-supplier=TME; ComponentLink15Description: https://datasheet.octopart.com:443/RC0402FR-071KL-Yageo-datasheet-148775077.pdf?src-supplier=TME; ComponentLink16URL: https://datasheet.octopart.com:443/RC0402FR-071KL-Yageo-datasheet-79472498.pdf?src-supplier=Megastar; ComponentLink16Description: https://datasheet.octopart.com:443/RC0402FR-071KL-Yageo-datasheet-79472498.pdf?src-supplier=Megastar; ComponentLink17URL: https://datasheet.octopart.com/RC0402FR-071KL-Yageo-datasheet-73766026.pdf; ComponentLink17Description: https://datasheet.octopart.com/RC0402FR-071KL-Yageo-datasheet-73766026.pdf; ComponentLink18URL: http://sigma.octopart.com:80/conflict_mineral_statement/Yageo-company-3.pdf?src-supplier=Compliance+Statements; ComponentLink18Description: http://sigma.octopart.com:80/conflict_mineral_statement/Yageo-company-3.pdf?src-supplier=Compliance+Statements; ComponentLink19URL: http://sigma.octopart.com:80/rohs_statement/Yageo-company-2.pdf?src-supplier=Compliance+Statements; ComponentLink19Description: http://sigma.octopart.com:80/rohs_statement/Yageo-company-2.pdf?src-supplier=Compliance+Statements; LCSC Part Number: C106235
R6 R7 R17 R19 = RC0402FR-0727RL: RES 27 OHM 1% 1/16W 0402; Manufacturer: Yageo Group; Max Power Dissipation: 63mW; Power Dissipation: 62.5mW; Value: 27Ω; Temperature Coefficient: 100ppm/°C; Supplier: DigiKey; Supplier Part Number: YAG3086CT-ND; Manufacturer Part Number: RC0402FR-0727RL; RoHS: Compliant; Category: Chip SMD Resistors; Stock: 411299; Pricing: 1=0.1, 10=0.007, 25=0.0068, 50=0.0062, 100=0.0051, 250=0.00308 (USD); Case/Package: 0402; Case Code (Imperial): 0402; Case Code (Metric): 1005; China RoHS: Non-Compliant; Composition: Thick Film; Depth: 500µm; Features: Moisture Resistant; Height: 350µm; Lead Free: Lead Free; Length: 1mm; Lifecycle Status: Production; Max Operating Temperature: 155°C; Military Standard: Not; Min Operating Temperature: -55°C; Mounting Technology: Surface Mount; Pins: 2; Number of Terminals: 2; Number of Terminations: 2; Power Rating: 63mW; REACH SVHC: Yes; Schedule B: 8533210045, 8533210045|8533210045, 8533210045|8533210045|8533210045, 8533210045|8533210045|8533210045|8533210045; Termination: SMD/SMT; Tolerance: 1%; Voltage Rating: 50V; Voltage Rating (AC): 50V; Voltage Rating (DC): 50V; Weight: 652.039032µg; Width: 500µm; Working Voltage: 50V; ComponentLink1URL: https://datasheet.octopart.com:443/RC0402FR-0727RL-Yageo-datasheet-175887523.pdf?src-supplier=Newark; ComponentLink1Description: https://datasheet.octopart.com:443/RC0402FR-0727RL-Yageo-datasheet-175887523.pdf?src-supplier=Newark; ComponentLink2URL: https://datasheet.octopart.com:443/RC0402FR-0727RL-Yageo-datasheet-8324527.pdf?src-supplier=Newark; ComponentLink2Description: https://datasheet.octopart.com:443/RC0402FR-0727RL-Yageo-datasheet-8324527.pdf?src-supplier=Newark; ComponentLink3URL: https://datasheet.octopart.com:443/RC0402FR-0727RL-Yageo-datasheet-103092701.pdf?src-supplier=Upverter; ComponentLink3Description: https://datasheet.octopart.com:443/RC0402FR-0727RL-Yageo-datasheet-103092701.pdf?src-supplier=Upverter; ComponentLink4URL: https://datasheet.octopart.com:443/RC0402FR-0727RL-Yageo-datasheet-10408619.pdf?src-supplier=element14+APAC; ComponentLink4Description: https://datasheet.octopart.com:443/RC0402FR-0727RL-Yageo-datasheet-10408619.pdf?src-supplier=element14+APAC; ComponentLink5URL: https://datasheet.octopart.com:443/RC0402FR-0727RL-Yageo-datasheet-62067350.pdf?src-supplier=element14+APAC; ComponentLink5Description: https://datasheet.octopart.com:443/RC0402FR-0727RL-Yageo-datasheet-62067350.pdf?src-supplier=element14+APAC; ComponentLink6URL: https://datasheet.octopart.com:443/RC0402FR-0727RL-Yageo-datasheet-175423674.pdf?src-supplier=SOS+electronic; ComponentLink6Description: https://datasheet.octopart.com:443/RC0402FR-0727RL-Yageo-datasheet-175423674.pdf?src-supplier=SOS+electronic; ComponentLink7URL: https://datasheet.octopart.com:443/RC0402FR-0727RL-Yageo-datasheet-8329306.pdf?src-supplier=SOS+electronic; ComponentLink7Description: https://datasheet.octopart.com:443/RC0402FR-0727RL-Yageo-datasheet-8329306.pdf?src-supplier=SOS+electronic; ComponentLink8URL: https://datasheet.octopart.com:443/RC0402FR-0727RL-Yageo-datasheet-164759695.pdf?src-supplier=Future+Electronics; ComponentLink8Description: https://datasheet.octopart.com:443/RC0402FR-0727RL-Yageo-datasheet-164759695.pdf?src-supplier=Future+Electronics; ComponentLink9URL: https://datasheet.octopart.com:443/RC0402FR-0727RL-Yageo-datasheet-137700087.pdf?src-supplier=Future+Electronics; ComponentLink9Description: https://datasheet.octopart.com:443/RC0402FR-0727RL-Yageo-datasheet-137700087.pdf?src-supplier=Future+Electronics; ComponentLink10URL: https://datasheet.octopart.com:443/RC0402FR-0727RL-Yageo-datasheet-12531192.pdf?src-supplier=Future+Electronics; ComponentLink10Description: https://datasheet.octopart.com:443/RC0402FR-0727RL-Yageo-datasheet-12531192.pdf?src-supplier=Future+Electronics; ComponentLink11URL: https://datasheet.octopart.com:443/RC0402FR-0727RL-Yageo-datasheet-148775077.pdf?src-supplier=TME; ComponentLink11Description: https://datasheet.octopart.com:443/RC0402FR-0727RL-Yageo-datasheet-148775077.pdf?src-supplier=TME; ComponentLink12URL: https://datasheet.octopart.com/RC0402FR-0727RL-Yageo-datasheet-73766026.pdf; ComponentLink12Description: https://datasheet.octopart.com/RC0402FR-0727RL-Yageo-datasheet-73766026.pdf; ComponentLink13URL: http://sigma.octopart.com:80/conflict_mineral_statement/Yageo-company-3.pdf?src-supplier=Compliance+Statements; ComponentLink13Description: http://sigma.octopart.com:80/conflict_mineral_statement/Yageo-company-3.pdf?src-supplier=Compliance+Statements; ComponentLink14URL: http://sigma.octopart.com:80/rohs_statement/Yageo-company-2.pdf?src-supplier=Compliance+Statements; ComponentLink14Description: http://sigma.octopart.com:80/rohs_statement/Yageo-company-2.pdf?src-supplier=Compliance+Statements; LCSC Part Number: C138021